# EAGLE schematic arduino clock divider (EAGLE 9.2.2)
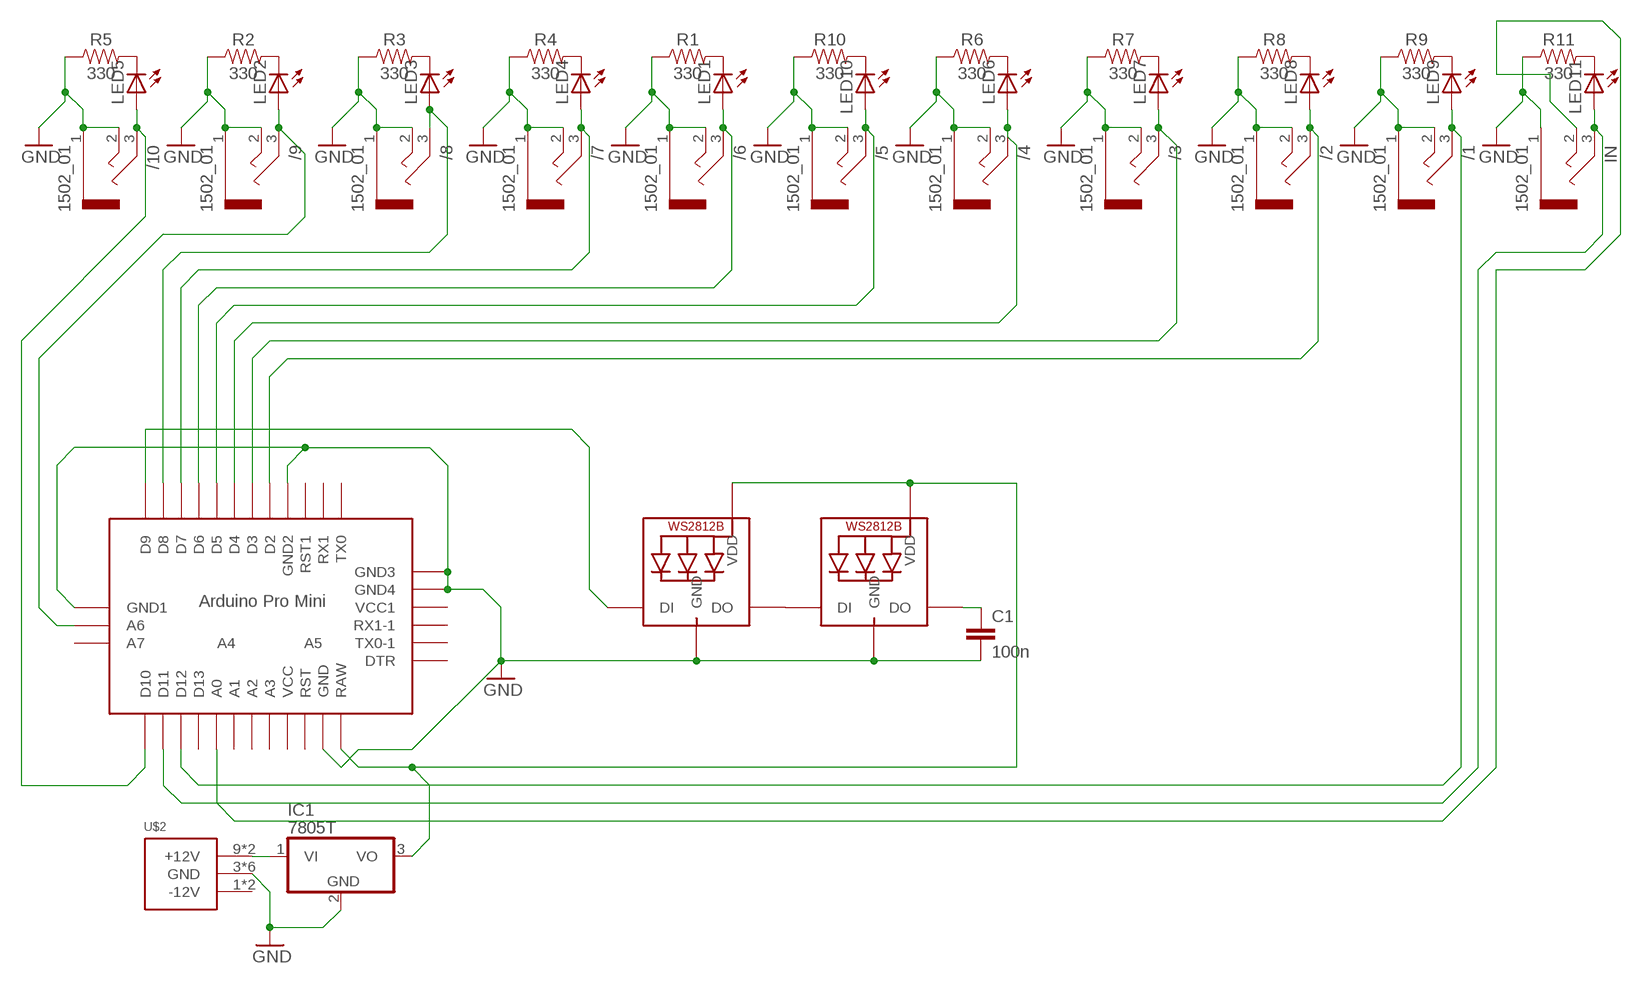
[diagram p0: schematic, sheet 1]

## Parts
/1  1502_01  [1502_01]
/2  1502_01  [1502_01]
/3  1502_01  [1502_01]
/4  1502_01  [1502_01]
/5  1502_01  [1502_01]
/6  1502_01  [1502_01]
/7  1502_01  [1502_01]
/8  1502_01  [1502_01]
/9  1502_01  [1502_01]
/10  1502_01  [1502_01]
C1  100n  C-EUC0603  [C0603]
IC1  7805T  [TO220H]
IN  1502_01  [1502_01]
LED1  LED5MM  [LED5MM]
LED2  LED5MM  [LED5MM]
LED3  LED5MM  [LED5MM]
LED4  LED5MM  [LED5MM]
LED5  LED5MM  [LED5MM]
LED6  LED5MM  [LED5MM]
LED7  LED5MM  [LED5MM]
LED8  LED5MM  [LED5MM]
LED9  LED5MM  [LED5MM]
LED10  LED5MM  [LED5MM]
LED11  LED5MM  [LED5MM]
LED12  WS2812B3535  [LED3535]
LED13  WS2812B3535  [LED3535]
R1  330  330OHM-HORIZ-1/10W-5%  [AXIAL-0.3]
R2  330  330OHM-HORIZ-1/10W-5%  [AXIAL-0.3]
R3  330  330OHM-HORIZ-1/10W-5%  [AXIAL-0.3]
R4  330  330OHM-HORIZ-1/10W-5%  [AXIAL-0.3]
R5  330  330OHM-HORIZ-1/10W-5%  [AXIAL-0.3]
R6  330  330OHM-HORIZ-1/10W-5%  [AXIAL-0.3]
R7  330  330OHM-HORIZ-1/10W-5%  [AXIAL-0.3]
R8  330  330OHM-HORIZ-1/10W-5%  [AXIAL-0.3]
R9  330  330OHM-HORIZ-1/10W-5%  [AXIAL-0.3]
R10  330  330OHM-HORIZ-1/10W-5%  [AXIAL-0.3]
R11  330  330OHM-HORIZ-1/10W-5%  [AXIAL-0.3]
U$1  ABK-PRO-MINI  [ABK-PRO-MINI]
U$2  POWER_SIMPLE10  [POWER_10]

## Nets
GND: /1.1 /1.2 /2.1 /2.2 /3.1 /3.2 /4.1 /4.2 /5.1 /5.2 /6.1 /6.2 /7.1 /7.2 /8.1 /8.2 /9.1 /9.2 /10.1 /10.2 C1.2 IC1.2(GND) IN.1 LED12.4(GND) LED13.4(GND) R1.P$1 R2.P$1 R3.P$1 R4.P$1 R5.P$1 R6.P$1 R7.P$1 R8.P$1 R9.P$1 R10.P$1 R11.P$1 U$1.GND U$1.GND1(GND2) U$1.GND2(GND3) U$1.GND3(GND4) U$1.GND4(GND1) U$2.3(GND) U$2.4(GND) U$2.5(GND) U$2.6(GND) U$2.7(GND) U$2.8(GND)
N$1: /6.3 LED1.A U$1.D6
N$2: LED1.K(C) R1.P$2
N$3: /9.3 LED2.A U$1.A6
N$4: LED2.K(C) R2.P$2
N$5: /8.3 LED3.A U$1.D8
N$6: LED3.K(C) R3.P$2
N$7: /5.3 LED10.A U$1.D5
N$8: LED4.K(C) R4.P$2
N$9: /10.3 LED5.A U$1.D10
N$10: LED5.K(C) R5.P$2
N$11: /4.3 LED6.A U$1.D4
N$12: LED6.K(C) R6.P$2
N$13: /3.3 LED7.A U$1.D3
N$14: LED7.K(C) R7.P$2
N$15: /2.3 LED8.A U$1.D2
N$16: LED8.K(C) R8.P$2
N$17: /1.3 LED9.A U$1.D12
N$18: LED9.K(C) R9.P$2
N$19: IC1.1(VI) U$2.9(+12V) U$2.10(+12V)
N$20: LED10.K(C) R10.P$2
N$21: IN.3 LED11.A U$1.D11
N$22: LED11.K(C) R11.P$2
N$23: IN.2 U$1.A0
N$24: LED12.1(DI) U$1.D9
N$25: /7.3 LED4.A U$1.D7
N$26: LED12.3(DO) LED13.1(DI)
N$27: IC1.3(VO) LED12.2(VDD) LED13.2(VDD) U$1.RAW
N$28: C1.1 LED13.3(DO)
Unconnected: U$1.A1 U$1.A2 U$1.A3 U$1.A4 U$1.A5 U$1.A7 U$1.D13 U$1.DTR U$1.RST U$1.RST1 U$1.RX1 U$1.RX1-1 U$1.TX0 U$1.TX0-1 U$1.VCC U$1.VCC1 U$2.1(-12V) U$2.2(-12V)

## Library data of the parts
/1-/10 IN = con-lumberg:1502_01: Jack connectors according to JISC 6560, 3.5 mm Klinkensteckverbinder nach JISC 6560, 3,5 mm Source: http://www.lumberg.com/Produkte/PDFs/1502_01.pdf; OC_FARNELL: 4739747; OC_NEWARK: unknown
C1 = resistor:C-EU: CAPACITOR, European symbol
IC1 = adafruit:78*: Positive VOLTAGE REGULATOR Added bigger pads to the TO-92 package
LED1-LED11 = led:LED: LED OSRAM: - CHIPLED LG R971, LG N971, LY N971, LG Q971, LY Q971, LO R971, LY R971 LH N974, LH R974 LS Q976, LO Q976, LY Q976 LO Q996 - Hyper CHIPLED LW Q18S LB Q993, LB Q99A, LB R99A - SideLED LS A670, LO A670, LY A670, LG A670, LP A670 LB A673, LV A673, LT A673, LW A673 LH A674 LY A675 LS A676, LA A676, LO A676, LY A676, LW A676 LS A679, LY A679, LG A679 - Hyper Micro SIDELED® LS Y876, LA Y876, LO Y876, LY Y876 LT Y87S - SmartLED LW L88C, LW L88S LB L89C, LB L89S, LG L890 LS L89K, LO L89K, LY L89K LS L896, LA L896, LO L896, LY L896 - TOPLED LS T670, LO T670, LY T670, LG T670, LP T670 LSG T670, LSP T670, LSY T670, LOP T670, LYG T670 LG T671, LOG T671, LSG T671 LB T673, LV T673, LT T673, LW T673 LH T674 LS T676, LA T676, LO T676, LY T676, LB T676, LH T676, LSB T676, LW T676 LB T67C, LV T67C, LT T67C, LS T67K, LO T67K, LY T67K, LW E67C LS E67B, LA E67B, LO E67B, LY E67B, LB E67C, LV E67C, LT E67C LW T67C LS T679, LY T679, LG T679 LS T770, LO T770, LY T770, LG T770, LP T770 LB T773, LV T773, LT T773, LW T773 LH T774 LS E675, LA E675, LY E675, LS T675 LS T776, LA T776, LO T776, LY T776, LB T776 LHGB T686 LT T68C, LB T68C - Hyper Mini TOPLED® LB M676 - Mini TOPLED Santana® LG M470 LS M47K, LO M47K, LY M47K Source: http://www.osram.convergy.de LUXEON: - LUMILED® LXK2-PW12-R00, LXK2-PW12-S00, LXK2-PW14-U00, LXK2-PW14-V00 LXK2-PM12-R00, LXK2-PM12-S00, LXK2-PM14-U00 LXK2-PE12-Q00, LXK2-PE12-R00, LXK2-PE12-S00, LXK2-PE14-T00, LXK2-PE14-U00 LXK2-PB12-K00, LXK2-PB12-L00, LXK2-PB12-M00, LXK2-PB14-N00, LXK2-PB14-P00, LXK2-PB14-Q00 LXK2-PR12-L00, LXK2-PR12-M00, LXK2-PR14-Q00, LXK2-PR14-R00 LXK2-PD12-Q00, LXK2-PD12-R00, LXK2-PD12-S00 LXK2-PH12-R00, LXK2-PH12-S00 LXK2-PL12-P00, LXK2-PL12-Q00, LXK2-PL12-R00 Source: www.luxeon.com KINGBRIGHT: KA-3528ASYC Source: www.kingbright.com
LED12 LED13 = adafruit:WS2812B
R1-R11 = SparkFun-Resistors:330OHM: 330Ω resistor A resistor is a passive two-terminal electrical component that implements electrical resistance as a circuit element. Resistors act to reduce current flow, and, at the same time, act to lower voltage levels within circuits. - Wikipedia; PROD_ID: RES-8371
U$1 = Arduino-clone:ABK-PRO-MINI: ABK Pro-Mini Arduino Clone
U$2 = eurorack:POWER_SIMPLE